# EAGLE schematic PKG900000001527 (EAGLE 7.7.0)

## Sheet 1 of 8
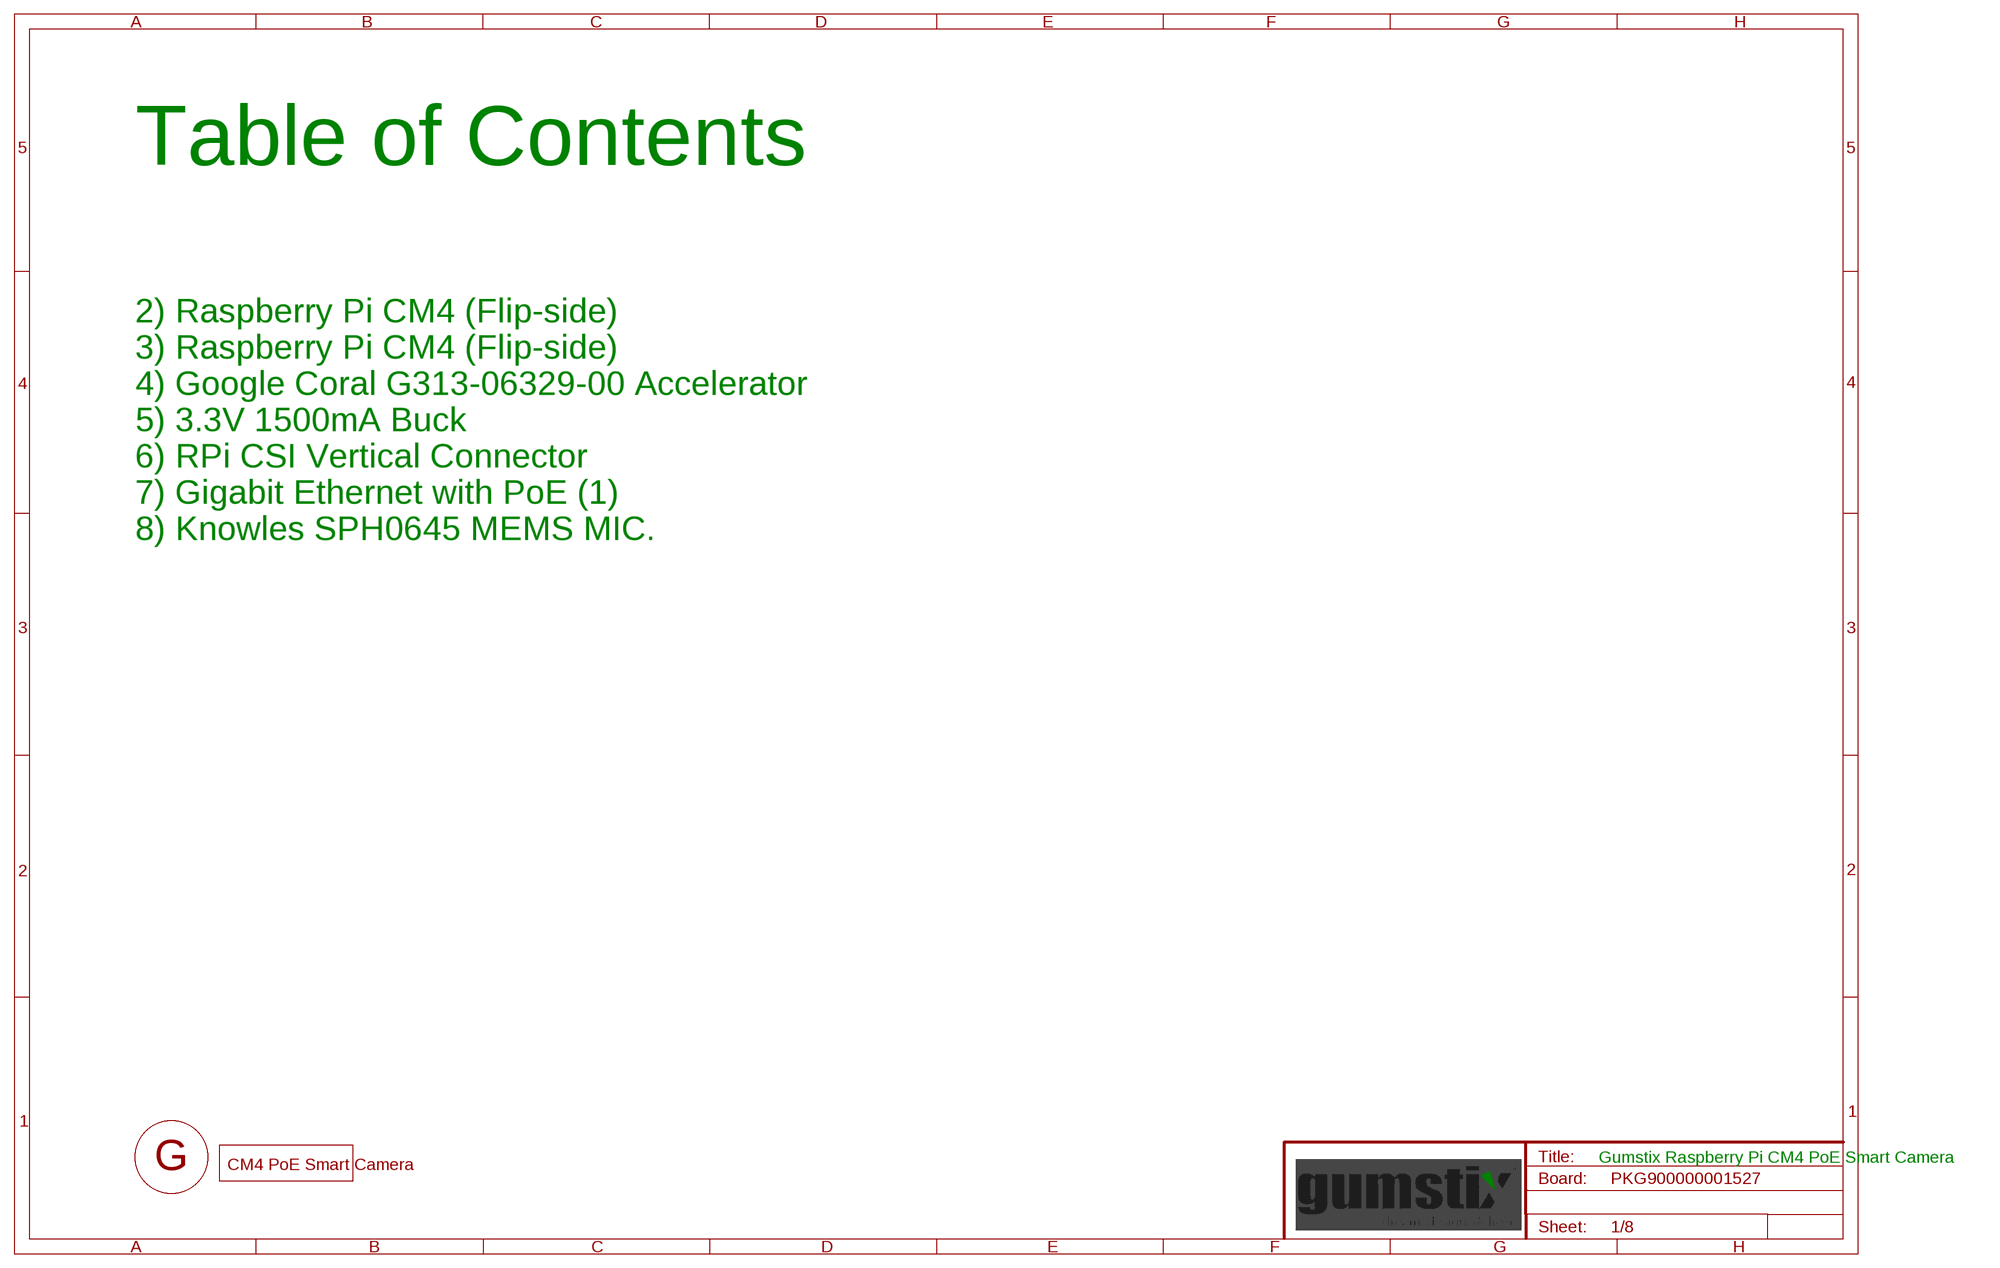
[diagram p0: schematic, sheet 1]

### Parts
FD1  DNP  FIDUCIAL  [FIDUCIAL]
FD2  DNP  FIDUCIAL  [FIDUCIAL]
FD3  DNP  FIDUCIAL  [FIDUCIAL]
FD4  DNP  FIDUCIAL  [FIDUCIAL]
FD5  DNP  FIDUCIAL  [FIDUCIAL]
FD6  DNP  FIDUCIAL  [FIDUCIAL]
U$2  DNP  GEPPETTO_LABEL"  [GEPPETTO_LABEL]
U$3  DNP  GEPPETTO_LOGO10X10  [GEPPETTO_LOGO_SILK10]

### Notes on the sheet
- Table of Contents
- 2) Raspberry Pi CM4 (Flip-side)
- 3) Raspberry Pi CM4 (Flip-side)
- 4) Google Coral G313-06329-00 Accelerator
- 5) 3.3V 1500mA Buck
- 6) RPi CSI Vertical Connector
- 7) Gigabit Ethernet with PoE (1)
- 8) Knowles SPH0645 MEMS MIC.
- Gumstix Raspberry Pi CM4 PoE Smart Camera

## Sheet 2 of 8
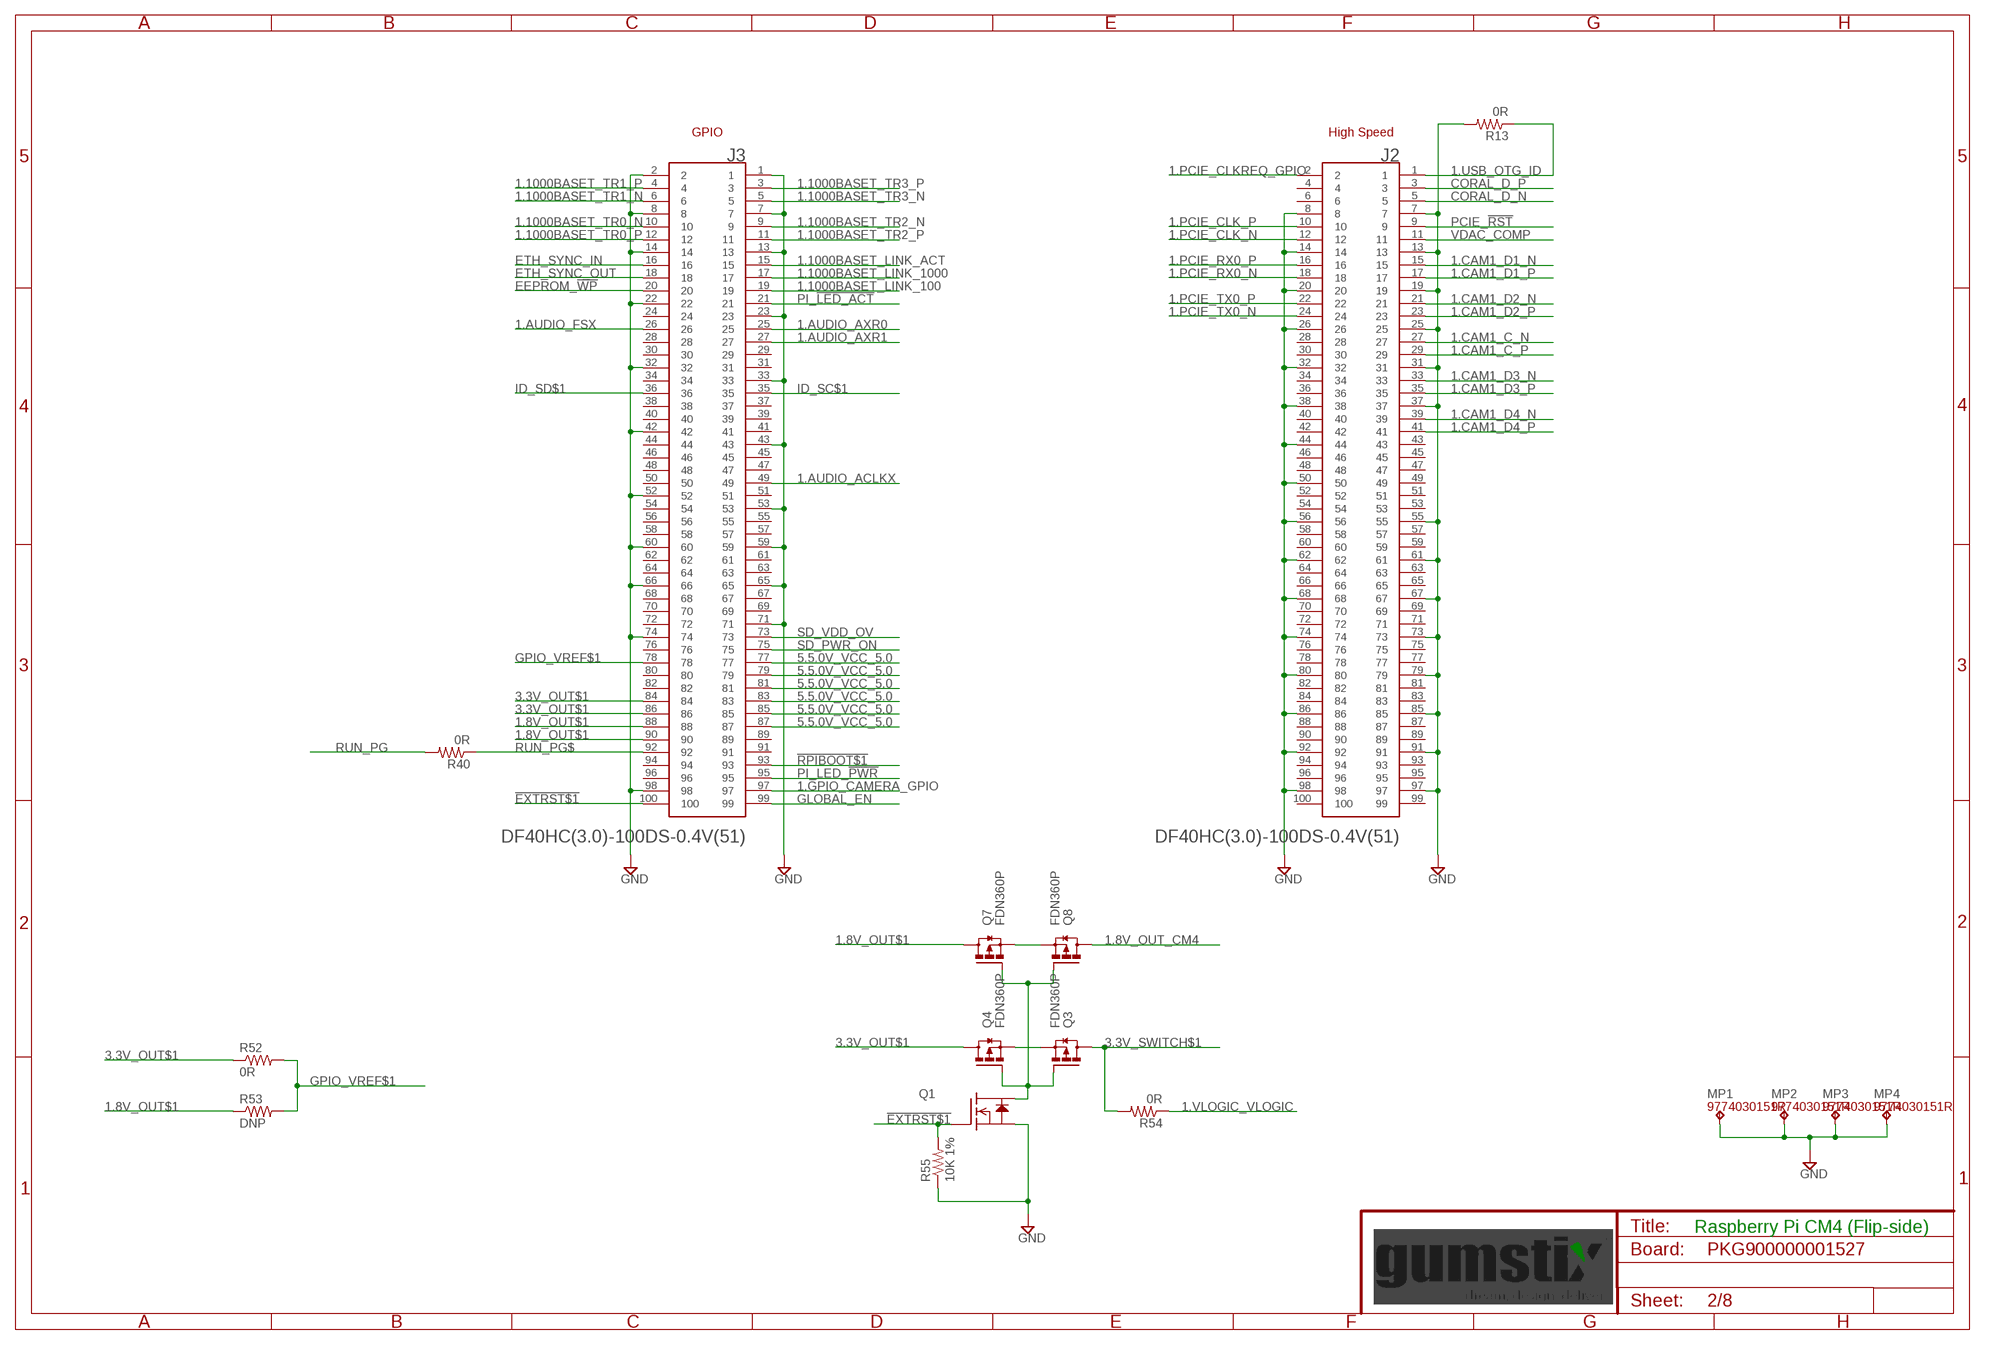
[diagram p1: schematic, sheet 2]

### Parts
J2  DF40HC(3.0)-100DS-0.4V(51)  DF40C-100DS-0.4V(51)  [HRS_DF40C-100DS-0.4V(51)]
J3  DF40HC(3.0)-100DS-0.4V(51)  DF40C-100DS-0.4V(51)  [HRS_DF40C-100DS-0.4V(51)]
MP1  9774030151R  BULLET_CONN2.5MM  [WA-SMSI_9774___151]
MP2  9774030151R  BULLET_CONN2.5MM  [WA-SMSI_9774___151]
MP3  9774030151R  BULLET_CONN2.5MM  [WA-SMSI_9774___151]
MP4  9774030151R  BULLET_CONN2.5MM  [WA-SMSI_9774___151]
Q1  BSS138  [SOT23]
Q3  FDN360P  MOSFET_P_ENH  [SOT23]
Q4  FDN360P  MOSFET_P_ENH  [SOT23]
Q7  FDN360P  MOSFET_P_ENH  [SOT23]
Q8  FDN360P  MOSFET_P_ENH  [SOT23]
R13  0R  R0201  [0201]
R40  0R  R0201  [0201]
R52  0R  R0201  [0201]
R53  DNP  R0201  [0201]
R54  0R  R0201  [0201]
R55  10K 1%  R0201  [0201]

### Nets
1.8V_OUT$1 [supply]: J3.88 J3.90 Q7.3(D) R53.1
1.8V_OUT_CM4: Q8.3(D) ; also sheet 4
1.1000BASET_LINK_100: J3.19
1.1000BASET_LINK_1000: J3.17 ; also sheet 7
1.1000BASET_LINK_ACT: J3.15 ; also sheet 7
1.1000BASET_TR0_N [HDMI]: J3.10 ; also sheet 7
1.1000BASET_TR0_P [HDMI]: J3.12 ; also sheet 7
1.1000BASET_TR1_N [HDMI]: J3.6 ; also sheet 7
1.1000BASET_TR1_P [HDMI]: J3.4 ; also sheet 7
1.1000BASET_TR2_N [HDMI]: J3.9 ; also sheet 7
1.1000BASET_TR2_P [HDMI]: J3.11 ; also sheet 7
1.1000BASET_TR3_N [HDMI]: J3.5 ; also sheet 7
1.1000BASET_TR3_P [HDMI]: J3.3 ; also sheet 7
1.AUDIO_ACLKX: J3.49 ; also sheet 8
1.AUDIO_AXR0: J3.25
1.AUDIO_AXR1: J3.27 ; also sheet 8
1.AUDIO_FSX: J3.26 ; also sheet 8
1.CAM1_C_N [HDMI]: J2.27 ; also sheet 6
1.CAM1_C_P [HDMI]: J2.29 ; also sheet 6
1.CAM1_D1_N [HDMI]: J2.15 ; also sheet 6
1.CAM1_D1_P [HDMI]: J2.17 ; also sheet 6
1.CAM1_D2_N [HDMI]: J2.21 ; also sheet 6
1.CAM1_D2_P [HDMI]: J2.23 ; also sheet 6
1.CAM1_D3_N [HDMI]: J2.33
1.CAM1_D3_P [HDMI]: J2.35
1.CAM1_D4_N [HDMI]: J2.39
1.CAM1_D4_P [HDMI]: J2.41
1.GPIO_CAMERA_GPIO: J3.97 ; also sheet 6
1.PCIE_CLK_N [USB]: J2.12 ; also sheet 4
1.PCIE_CLK_P [USB]: J2.10 ; also sheet 4
1.PCIE_CLKREQ_GPIO: J2.2 ; also sheet 4
1.PCIE_RX0_N [USB]: J2.18 ; also sheet 4
1.PCIE_RX0_P [USB]: J2.16 ; also sheet 4
1.PCIE_TX0_N [USB]: J2.24 ; also sheet 4
1.PCIE_TX0_P [USB]: J2.22 ; also sheet 4
1.USB_OTG_ID: J2.1 R13.1
1.VLOGIC_VLOGIC [supply]: R54.1 ; also sheet 4
3.3V_OUT$1 [supply]: J3.84 J3.86 Q4.3(D) R52.1
3.3V_SWITCH$1 [supply]: Q3.3(D) R54.2
5.5.0V_VCC_5.0 [supply]: J3.77 J3.79 J3.81 J3.83 J3.85 J3.87 ; also sheet 5,7
!EXTRST$1: J3.100 Q1.1(G) R55.2
!RPIBOOT$1: J3.93 ; also sheet 3
CORAL_D_N [USB]: J2.5 ; also sheet 4
CORAL_D_P [USB]: J2.3 ; also sheet 4
DS_LOAD$1 [supply]: Q3.2(S) Q4.2(S)
DS_LOAD_1V8$1 [supply]: Q7.2(S) Q8.2(S)
EEPROM_!WP: J3.20
ETH_SYNC_IN: J3.16
ETH_SYNC_OUT: J3.18
GLOBAL_EN: J3.99
GND [supply]: J2.7 J2.8 J2.13 J2.14 J2.19 J2.20 J2.25 J2.26 J2.31 J2.32 J2.37 J2.38 J2.44 J2.50 J2.55 J2.56 J2.61 J2.62 J2.67 J2.68 J2.73 J2.74 J2.79 J2.80 J2.85 J2.86 J2.91 J2.92 J2.97 J2.98 J3.1 J3.2 J3.7 J3.8 J3.13 J3.14 J3.22 J3.23 J3.32 J3.33 J3.42 J3.43 J3.52 J3.53 J3.59 J3.60 J3.65 J3.66 J3.71 J3.74 J3.98 MP1.1(TP) MP2.1(TP) MP3.1(TP) MP4.1(TP) Q1.2(S) R13.2 R55.1 ; also sheet 3,4,5,6,7,8
GPIO_VREF$1 [supply]: J3.78 R52.2 R53.2 ; also sheet 3
ID_SC$1: J3.35 ; also sheet 3
ID_SD$1: J3.36 ; also sheet 3
LOAD_GATE$1: Q1.3(D) Q3.1(G) Q4.1(G) Q7.1(G) Q8.1(G)
PCIE_!RST: J2.9
PI_!LED_ACT: J3.21
PI_LED_!PWR: J3.95
RUN_PG: R40.2 ; also sheet 4
RUN_PG$: J3.92 R40.1
SD_PWR_ON: J3.75
SD_VDD_OV: J3.73
VDAC_COMP: J2.11
Unconnected: J2.4 J2.6 J2.28 J2.30 J2.34 J2.36 J2.40 J2.42 J2.43 J2.45 J2.46 J2.47 J2.48 J2.49 J2.51 J2.52 J2.53 J2.54 J2.57 J2.58 J2.59 J2.60 J2.63 J2.64 J2.65 J2.66 J2.69 J2.70 J2.71 J2.72 J2.75 J2.76 J2.77 J2.78 J2.81 J2.82 J2.83 J2.84 J2.87 J2.88 J2.89 J2.90 J2.93 J2.94 J2.95 J2.96 J2.99 J2.100 J3.24 J3.28 J3.29 J3.30 J3.31 J3.34 J3.37 J3.38 J3.39 J3.40 J3.41 J3.44 J3.45 J3.46 J3.47 J3.48 J3.50 J3.51 J3.54 J3.55 J3.56 J3.57 J3.58 J3.61 J3.62 J3.63 J3.64 J3.67 J3.68 J3.69 J3.70 J3.72 J3.76 J3.80 J3.82 J3.89 J3.91 J3.94 J3.96

### Notes on the sheet
- GPIO | High Speed
- Raspberry Pi CM4 (Flip-side)

## Sheet 3 of 8
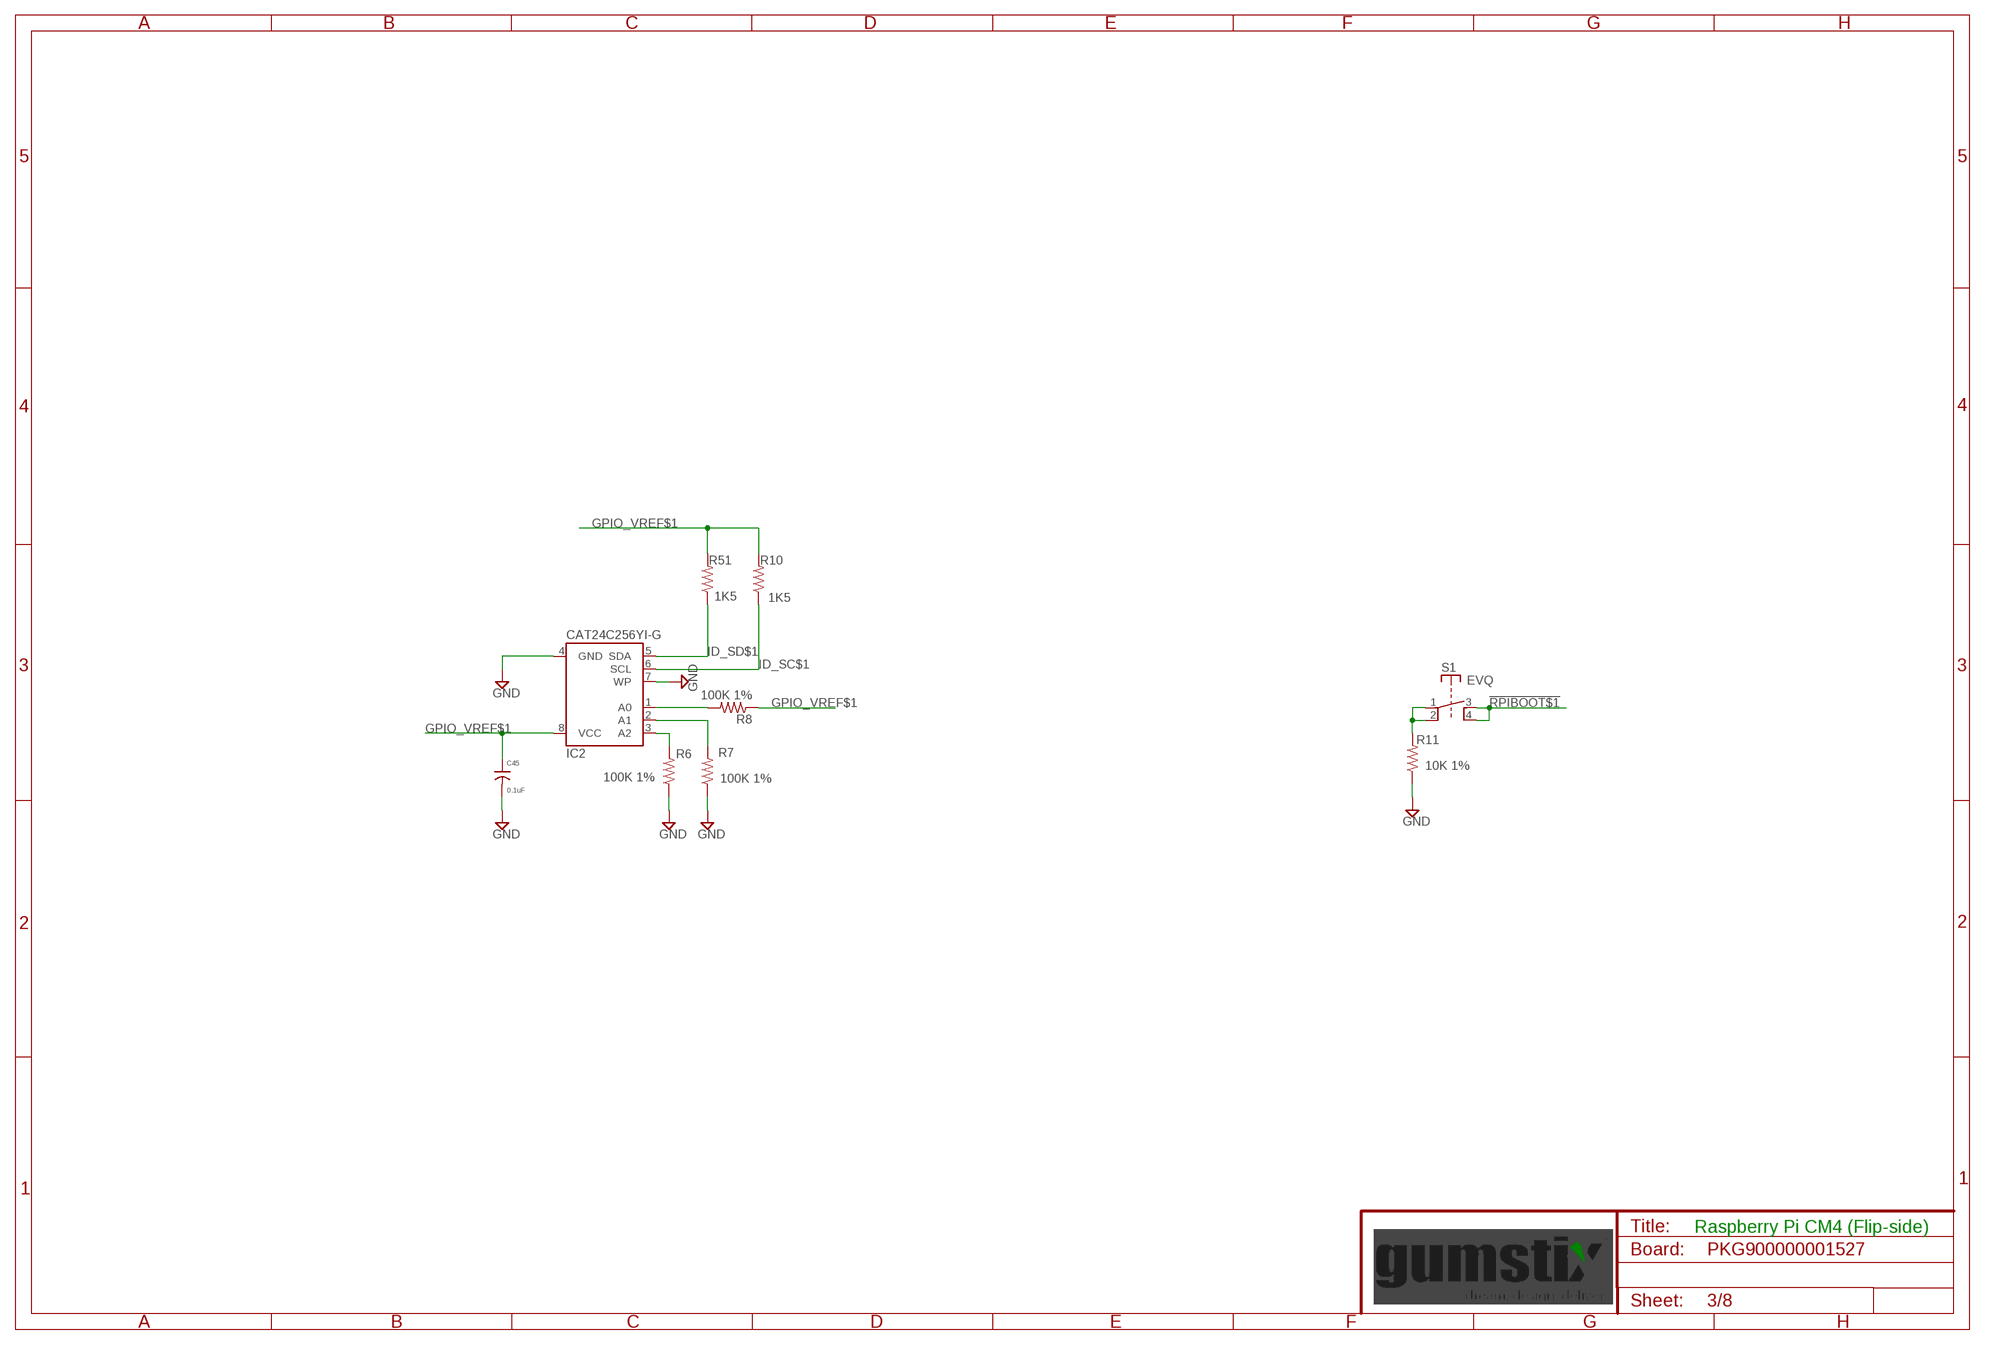
[diagram p2: schematic, sheet 3]

### Parts
C45  0.1uF  C0201  [0201]
IC2  CAT24C256YI-G  AT24CA  [TSSOP8]
R6  100K 1%  R0201  [0201]
R7  100K 1%  R0201  [0201]
R8  100K 1%  R0201  [0201]
R10  1K5  R0201  [0201]
R11  10K 1%  R0201  [0201]
R51  1K5  R0201  [0201]
S1  EVQ  EVQKMT0  [KMT0]

### Nets
!RPIBOOT$1: S1.3(B) S1.4(B') ; also sheet 2
A0$1: IC2.1(A0) R8.2
A1$1: IC2.2(A1) R7.2
A2$1: IC2.3(A2) R6.2
GND [supply]: C45.2 IC2.4(GND) IC2.7(WP) R6.1 R7.1 R11.1 ; also sheet 2,4,5,6,7,8
GPIO_VREF$1 [supply]: C45.1 IC2.8(VCC) R8.1 R10.2 R51.2 ; also sheet 2
ID_SC$1: IC2.6(SCL) R10.1 ; also sheet 2
ID_SD$1: IC2.5(SDA) R51.1 ; also sheet 2
RPIBOOT_SWITCH$1: R11.2 S1.1(A) S1.2(A')

### Notes on the sheet
- Raspberry Pi CM4 (Flip-side)

## Sheet 4 of 8
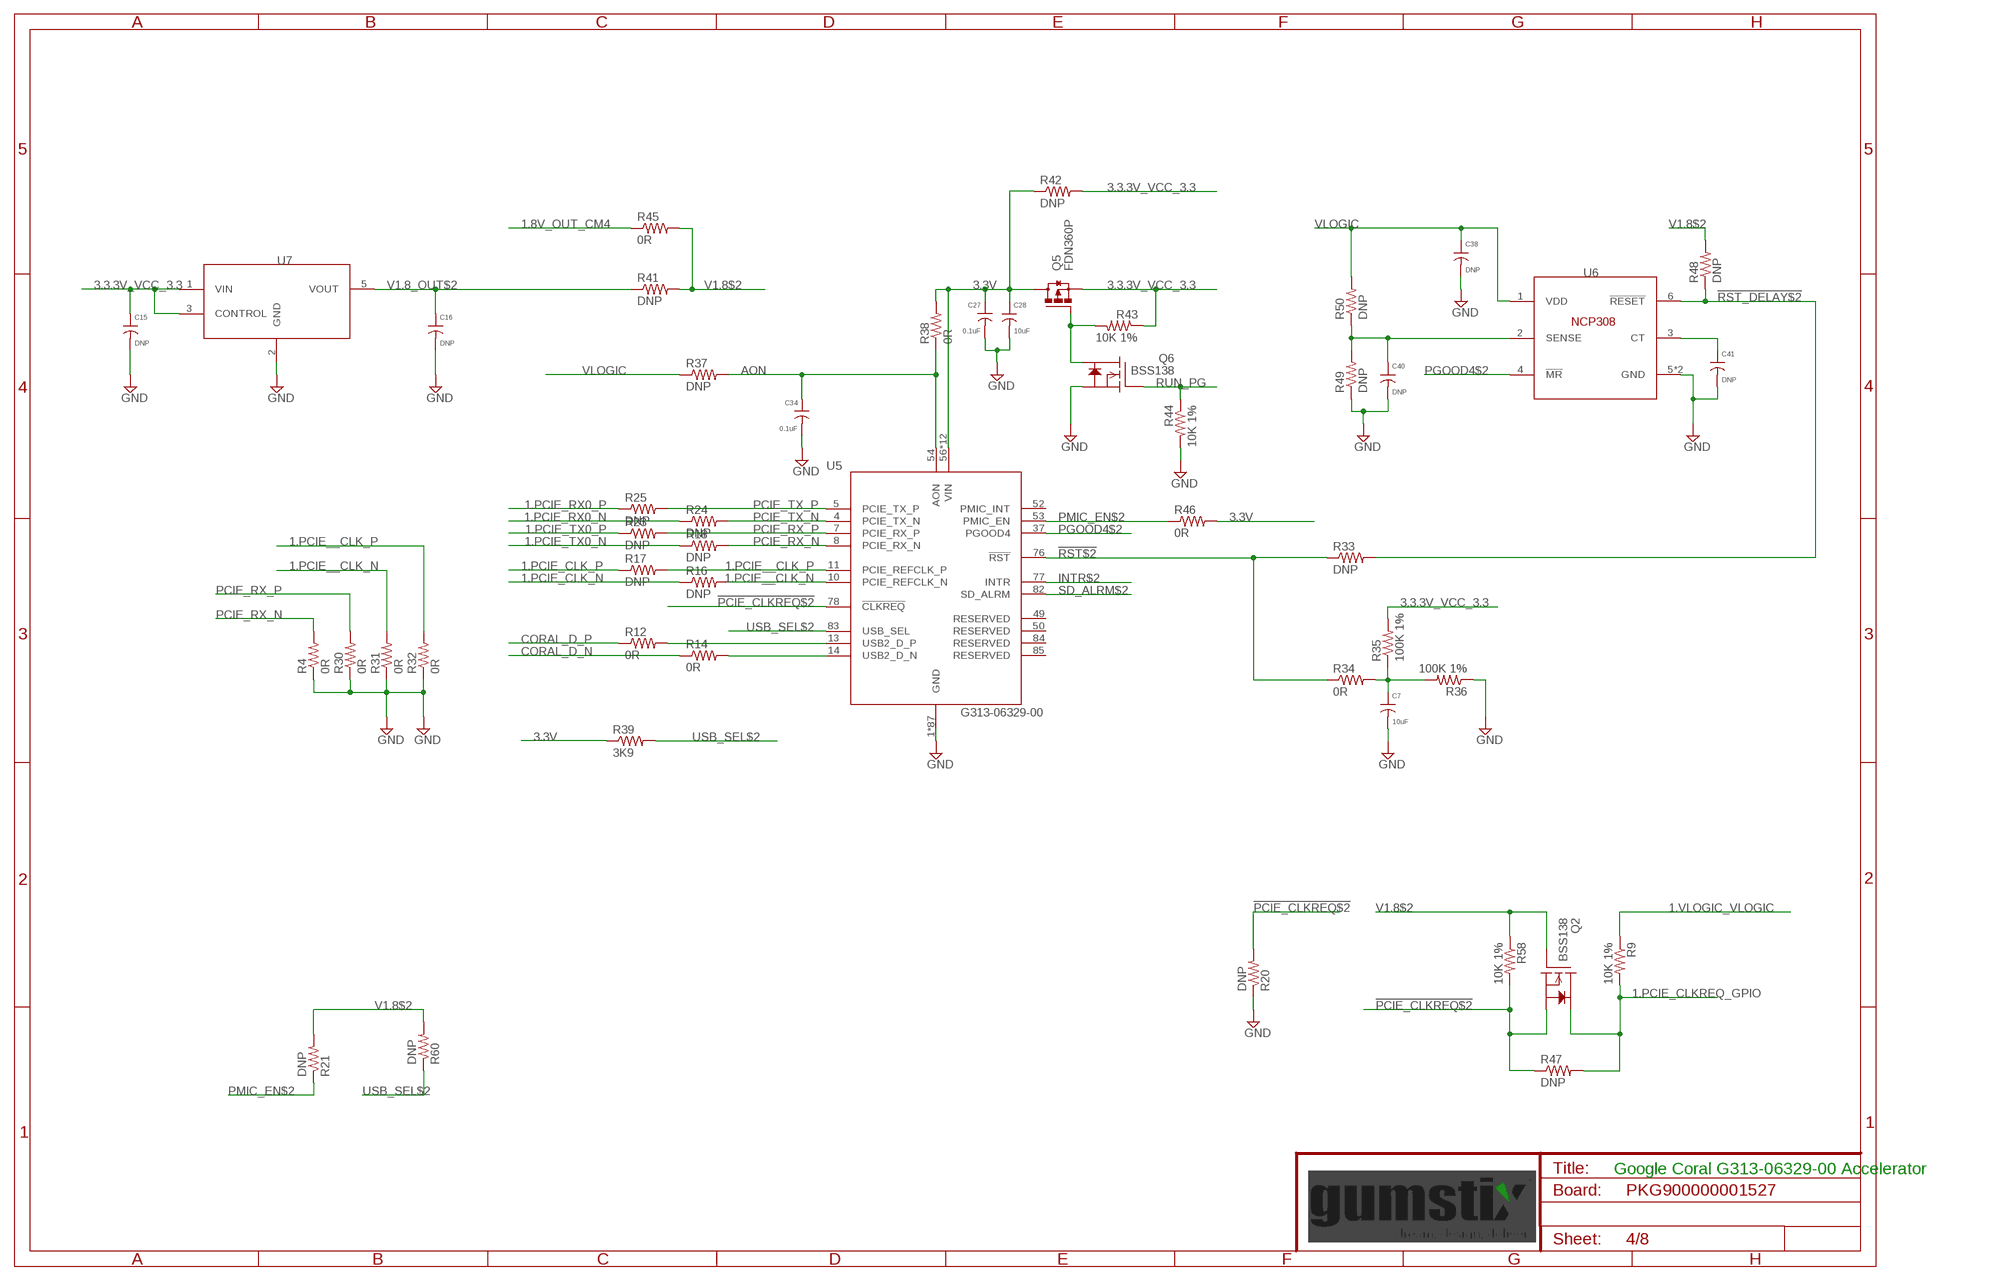
[diagram p3: schematic, sheet 4]

### Parts
C7  10uF  C0603  [0603]
C15  DNP  C0201  [0201]
C16  DNP  C0402  [0402]
C27  0.1uF  C0201  [0201]
C28  10uF  C0603  [0603]
C34  0.1uF  C0201  [0201]
C38  DNP  C0201  [0201]
C40  DNP  C0201  [0201]
C41  DNP  C0201  [0201]
Q2  BSS138  [SOT23]
Q5  FDN360P  MOSFET_P_ENH  [SOT23]
Q6  BSS138  [SOT23]
R4  0R  R0201  [0201]
R9  10K 1%  R0201  [0201]
R12  0R  R0201  [0201]
R14  0R  R0201  [0201]
R16  DNP  R0201  [0201]
R17  DNP  R0201  [0201]
R18  DNP  R0201  [0201]
R20  DNP  R0201  [0201]
R21  DNP  R0201  [0201]
R23  DNP  R0201  [0201]
R24  DNP  R0201  [0201]
R25  DNP  R0201  [0201]
R30  0R  R0201  [0201]
R31  0R  R0201  [0201]
R32  0R  R0201  [0201]
R33  DNP  R0201  [0201]
R34  0R  R0201  [0201]
R35  100K 1%  R0201  [0201]
R36  100K 1%  R0201  [0201]
R37  DNP  R0201  [0201]
R38  0R  R0201  [0201]
R39  3K9  R0201  [0201]
R41  DNP  R0603  [0603]
R42  DNP  R0805  [0805]
R43  10K 1%  R0201  [0201]
R44  10K 1%  R0201  [0201]
R45  0R  R0603  [0603]
R46  0R  R0201  [0201]
R47  DNP  R0201  [0201]
R48  DNP  R0201  [0201]
R49  DNP  R0201  [0201]
R50  DNP  R0201  [0201]
R58  10K 1%  R0201  [0201]
R60  DNP  R0201  [0201]
U5  G313-06329-00  [G313-06329-00]
U6  DNP  NCP308  [WDFN6]
U7  DNP  TCR2EF18  [SOT-23-5]

### Nets
1.8V_OUT_CM4: R45.1 ; also sheet 2
1.PCIE__CLK_N [USB]: R16.2 R31.2 U5.10(PCIE_REFCLK_N)
1.PCIE__CLK_P [USB]: R17.2 R32.2 U5.11(PCIE_REFCLK_P)
1.PCIE_CLK_N [USB]: R16.1 ; also sheet 2
1.PCIE_CLK_P [USB]: R17.1 ; also sheet 2
1.PCIE_CLKREQ_GPIO: Q2.3(D) R9.2 R47.2 ; also sheet 2
1.PCIE_RX0_N [USB]: R24.1 ; also sheet 2
1.PCIE_RX0_P [USB]: R25.1 ; also sheet 2
1.PCIE_TX0_N [USB]: R18.1 ; also sheet 2
1.PCIE_TX0_P [USB]: R23.1 ; also sheet 2
1.VLOGIC_VLOGIC [supply]: R9.1 ; also sheet 2
3.3.3V_VCC_3.3 [supply]: C15.1 Q5.2(S) R35.2 R42.2 R43.1 U7.1(VIN) U7.3(CONTROL) ; also sheet 5,6,7,8
3.3V [supply]: C27.1 C28.1 Q5.3(D) R38.2 R39.1 R42.1 R46.2 U5.56(VIN) U5.57(VIN) U5.58(VIN) U5.59(VIN) U5.60(VIN) U5.61(VIN) U5.62(VIN) U5.63(VIN) U5.64(VIN) U5.65(VIN) U5.66(VIN) U5.67(VIN)
!PCIE_CLKREQ$2: Q2.2(S) R20.2 R47.1 R58.2 U5.78(!CLKREQ)
!RST$2: R33.1 R34.1 U5.76(!RST)
!RST_DELAY$2: R33.2 R48.1 U6.6(!RESET)
AON [supply]: C34.1 R37.2 R38.1 U5.54(AON)
CORAL_D__N [USB]: R14.2 U5.14(USB2_D_N)
CORAL_D__P [USB]: R12.2 U5.13(USB2_D_P)
CORAL_D_N [USB]: R14.1 ; also sheet 2
CORAL_D_P [USB]: R12.1 ; also sheet 2
CT1$2 [supply]: C41.1 U6.3(CT)
FET_ENABLE: Q5.1(G) Q6.3(D) R43.2
GND [supply]: C7.2 C15.2 C16.2 C27.2 C28.2 C34.2 C38.2 C40.2 C41.2 Q6.2(S) R4.1 R20.1 R30.1 R31.1 R32.1 R36.1 R44.2 R49.1 U5.1(GND) U5.2(GND) U5.3(GND) U5.6(GND) U5.9(GND) U5.12(GND) U5.15(GND) U5.16(GND) U5.17(GND) U5.18(GND) U5.19(GND) U5.20(GND) U5.21(GND) U5.22(GND) U5.23(GND) U5.24(GND) U5.25(GND) U5.26(GND) U5.27(GND) U5.28(GND) U5.29(GND) U5.30(GND) U5.31(GND) U5.32(GND) U5.33(GND) U5.34(GND) U5.35(GND) U5.36(GND) U5.38(GND) U5.39(GND) U5.40(GND) U5.41(GND) U5.42(GND) U5.43(GND) U5.44(GND) U5.45(GND) U5.46(GND) U5.47(GND) U5.48(GND) U5.51(GND) U5.55(GND) U5.68(GND) U5.69(GND) U5.70(GND) U5.71(GND) U5.72(GND) U5.73(GND) U5.74(GND) U5.75(GND) U5.79(GND) U5.80(GND) U5.81(GND) U5.86(GND) U5.87(GND) U5.88(GND) U5.89(GND) U5.90(GND) U5.91(GND) U5.92(GND) U5.93(GND) U5.94(GND) U5.95(GND) U5.96(GND) U5.97(GND) U5.98(GND) U5.99(GND) U5.100(GND) U5.101(GND) U5.102(GND) U5.103(GND) U5.104(GND) U5.105(GND) U5.106(GND) U5.107(GND) U5.108(GND) U5.109(GND) U5.110(GND) U5.111(GND) U5.112(GND) U5.113(GND) U5.114(GND) U5.115(GND) U5.116(GND) U5.117(GND) U5.118(GND) U5.119(GND) U5.120(GND) U6.5(GND) U6.EPAD(GND) U7.2(GND) ; also sheet 2,3,5,6,7,8
INTR$2: U5.77(INTR)
PCIE_RX_N [USB]: R4.2 R18.2 U5.8(PCIE_RX_N)
PCIE_RX_P [USB]: R23.2 R30.2 U5.7(PCIE_RX_P)
PCIE_TX_N [USB]: R24.2 U5.4(PCIE_TX_N)
PCIE_TX_P [USB]: R25.2 U5.5(PCIE_TX_P)
PGOOD4$2: U5.37(PGOOD4) U6.4(!MR)
PMIC_EN$2: R21.1 R46.1 U5.53(PMIC_EN)
RST_RC$: C7.1 R34.2 R35.1 R36.2
RUN_PG: Q6.1(G) R44.1 ; also sheet 2
SD_ALRM$2: U5.82(SD_ALRM)
SENSE$2: C40.1 R49.2 R50.1 U6.2(SENSE)
USB_SEL$2: R39.2 R60.1 U5.83(USB_SEL)
V1.8$2 [supply]: Q2.1(G) R21.2 R41.2 R45.2 R48.2 R58.1 R60.2
V1.8_OUT$2 [supply]: C16.1 R41.1 U7.5(VOUT)
VLOGIC [supply]: C38.1 R37.1 R50.2 U6.1(VDD)
Unconnected: U5.49(RESERVED) U5.50(RESERVED) U5.52(PMIC_INT) U5.84(RESERVED) U5.85(RESERVED)

### Notes on the sheet
- Google Coral G313-06329-00 Accelerator

## Sheet 5 of 8
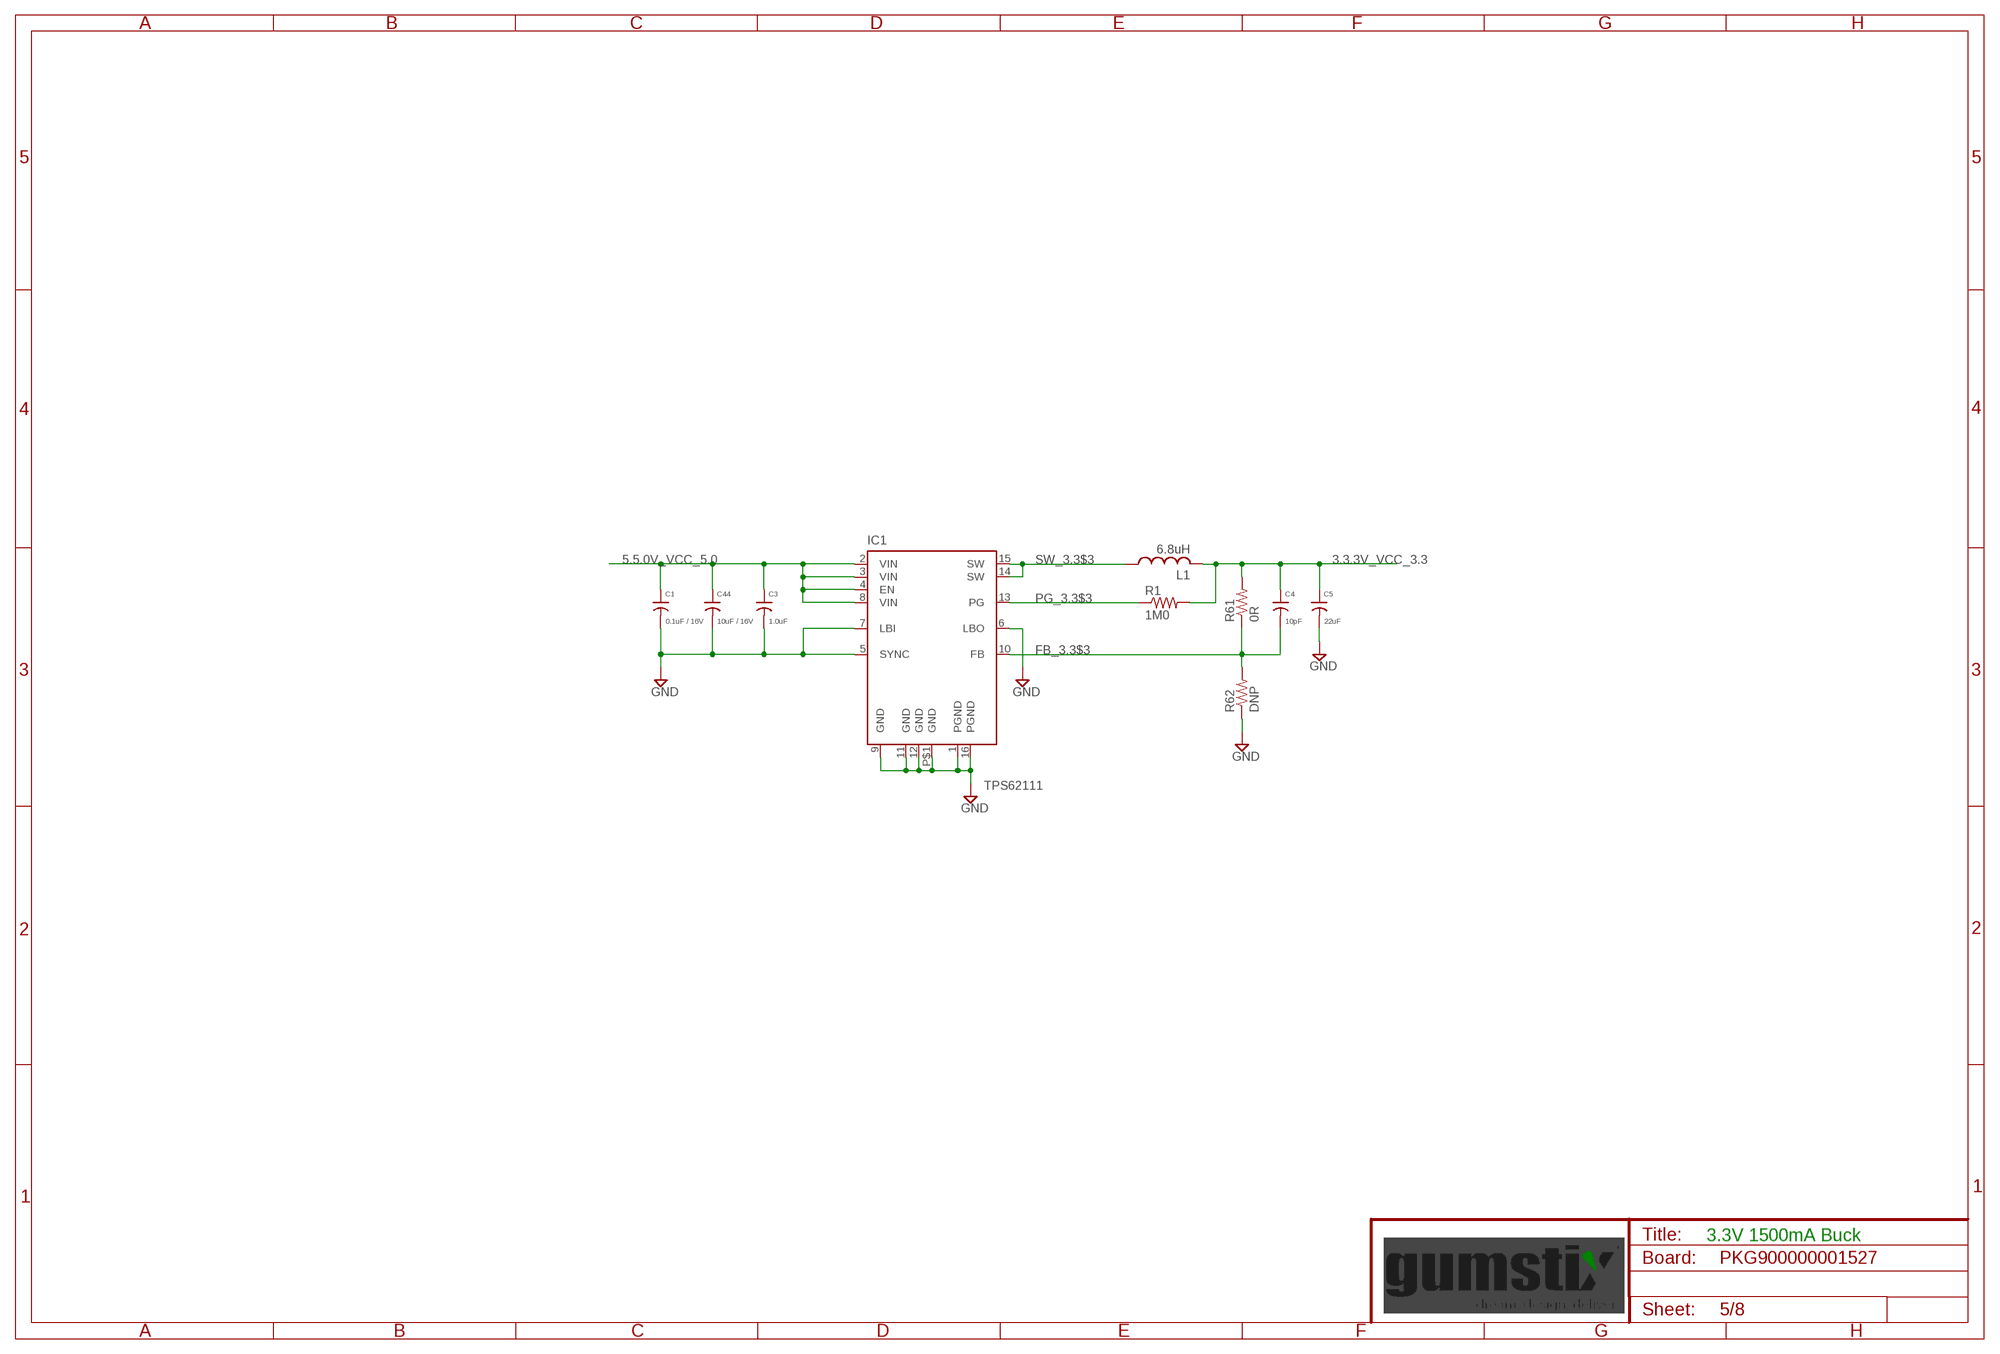
[diagram p4: schematic, sheet 5]

### Parts
C1  0.1uF / 16V  C0402  [0402]
C3  1.0uF  C0402  [0402]
C4  10pF  C0201  [0201]
C5  22uF  C0805  [0805]
C44  10uF / 16V  C0805  [0805]
IC1  TPS62111  [PQFP16]
L1  6.8uH  L1515  [1515]
R1  1M0  R0201  [0201]
R61  0R  R0402  [0402]
R62  DNP  R0402  [0402]

### Nets
3.3.3V_VCC_3.3 [supply]: C4.1 C5.1 L1.2 R1.2 R61.2 ; also sheet 4,6,7,8
5.5.0V_VCC_5.0 [supply]: C1.1 C3.1 C44.1 IC1.2(VIN) IC1.3(VIN) IC1.4(EN) IC1.8(VIN) ; also sheet 2,7
FB_3.3$3 [supply]: C4.2 IC1.10(FB) R61.1 R62.2
GND [supply]: C1.2 C3.2 C5.2 C44.2 IC1.1(PGND) IC1.5(SYNC) IC1.6(LBO) IC1.7(LBI) IC1.9(GND) IC1.11(GND) IC1.12(GND) IC1.16(PGND) IC1.P$1(GND) R62.1 ; also sheet 2,3,4,6,7,8
PG_3.3$3: IC1.13(PG) R1.1
SW_3.3$3 [supply]: IC1.14(SW) IC1.15(SW) L1.1

### Notes on the sheet
- 3.3V 1500mA Buck

## Sheet 6 of 8
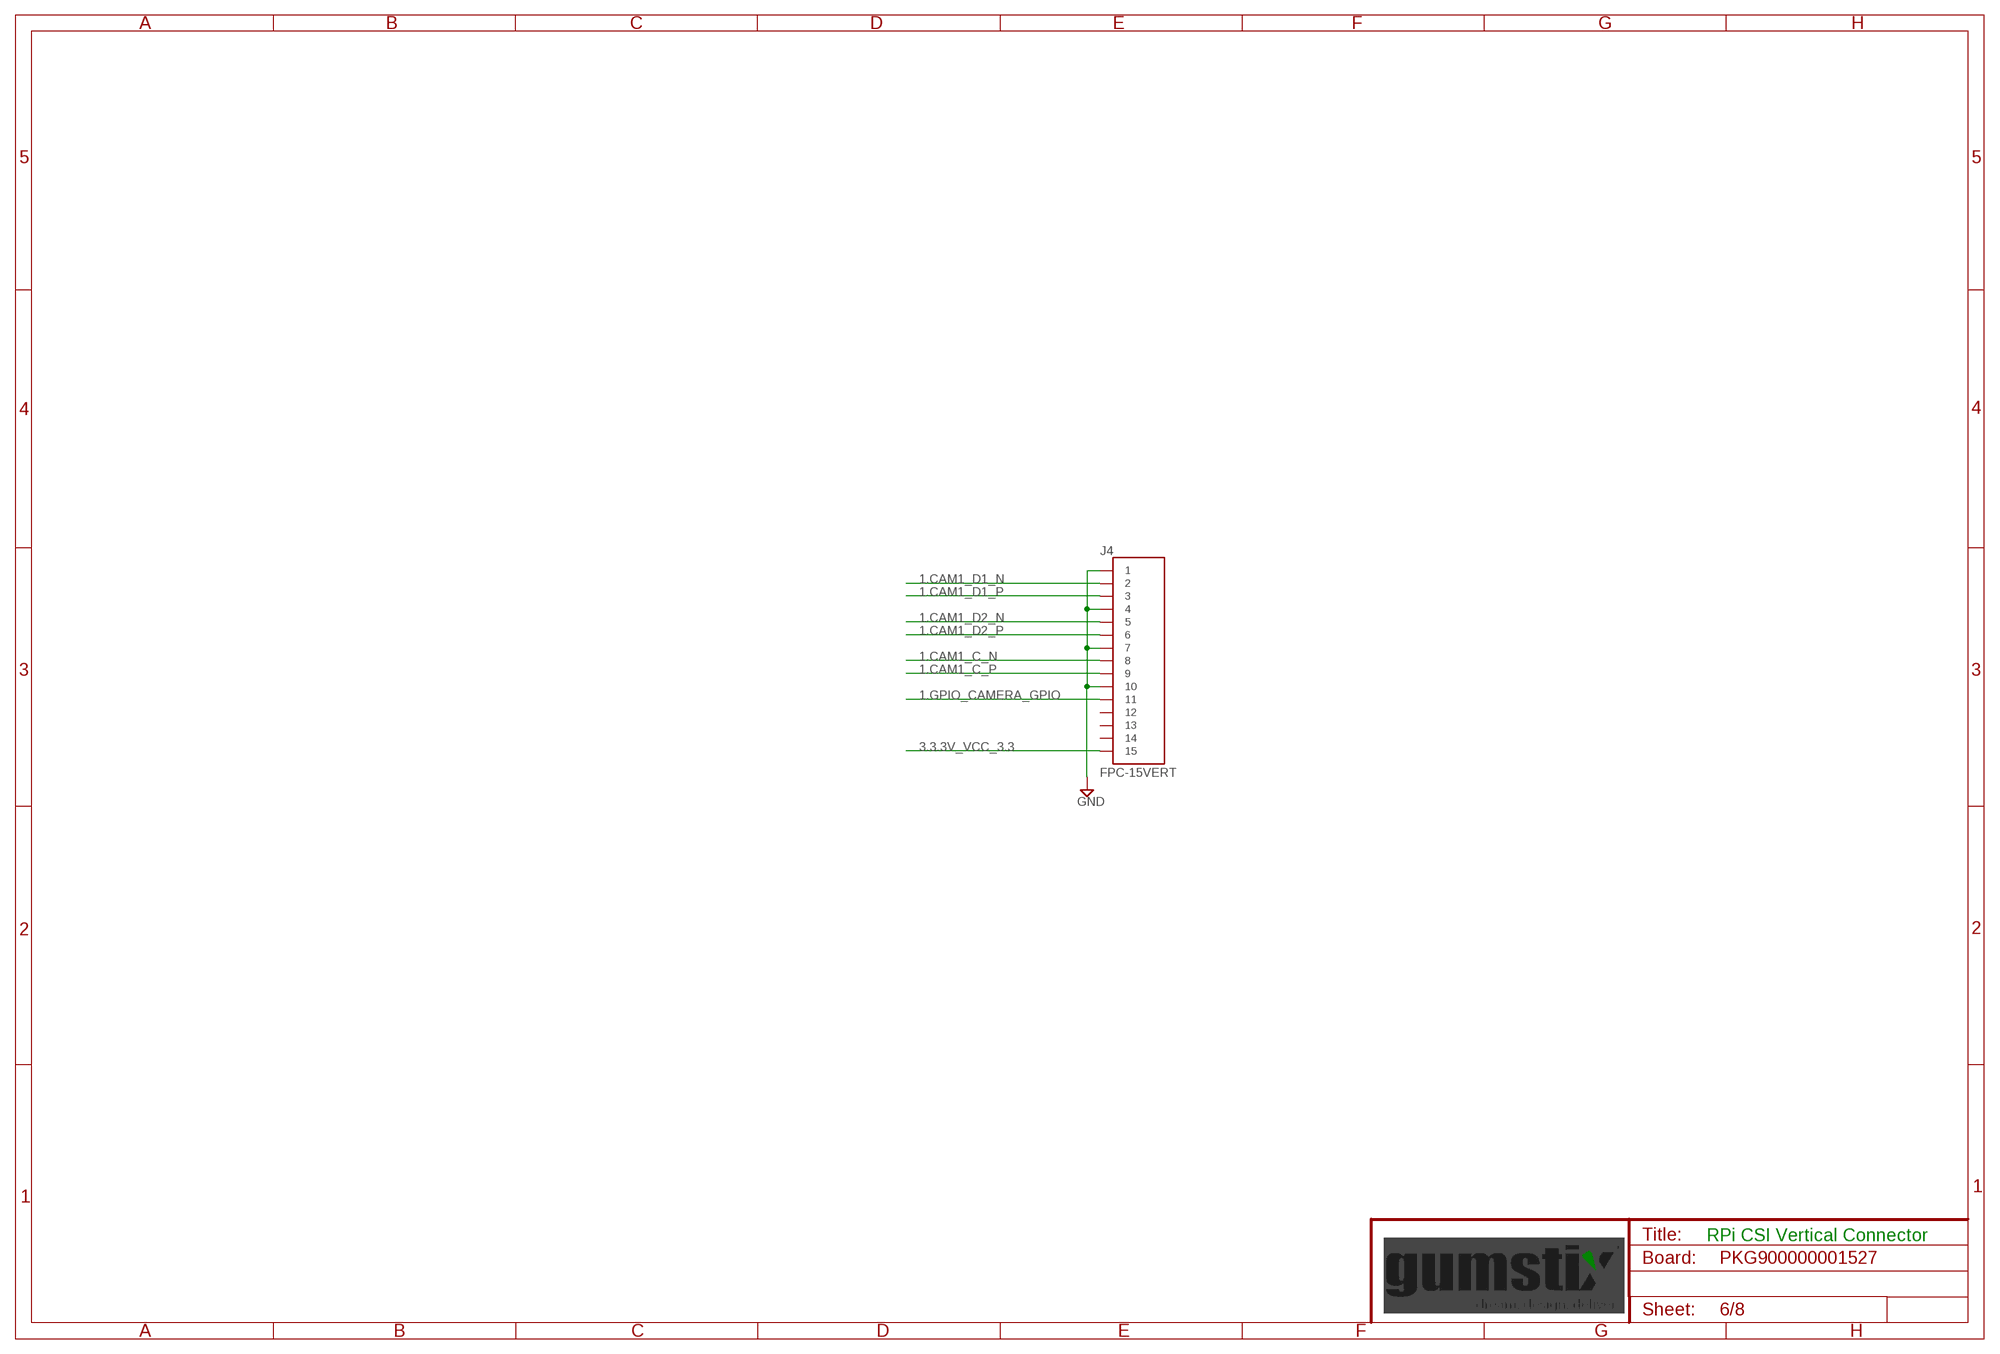
[diagram p5: schematic, sheet 6]

### Parts
J4  FPC-15VERT  [1-1734248-5]

### Nets
1.CAM1_C_N [HDMI]: J4.1_8 ; also sheet 2
1.CAM1_C_P [HDMI]: J4.1_9 ; also sheet 2
1.CAM1_D1_N [HDMI]: J4.1_2 ; also sheet 2
1.CAM1_D1_P [HDMI]: J4.1_3 ; also sheet 2
1.CAM1_D2_N [HDMI]: J4.1_5 ; also sheet 2
1.CAM1_D2_P [HDMI]: J4.1_6 ; also sheet 2
1.GPIO_CAMERA_GPIO: J4.1_11 ; also sheet 2
3.3.3V_VCC_3.3 [supply]: J4.1_15 ; also sheet 4,5,7,8
GND [supply]: J4.1_1 J4.1_4 J4.1_7 J4.1_10 ; also sheet 2,3,4,5,7,8
Unconnected: J4.1_12 J4.1_13 J4.1_14

### Notes on the sheet
- RPi CSI Vertical Connector

## Sheet 7 of 8
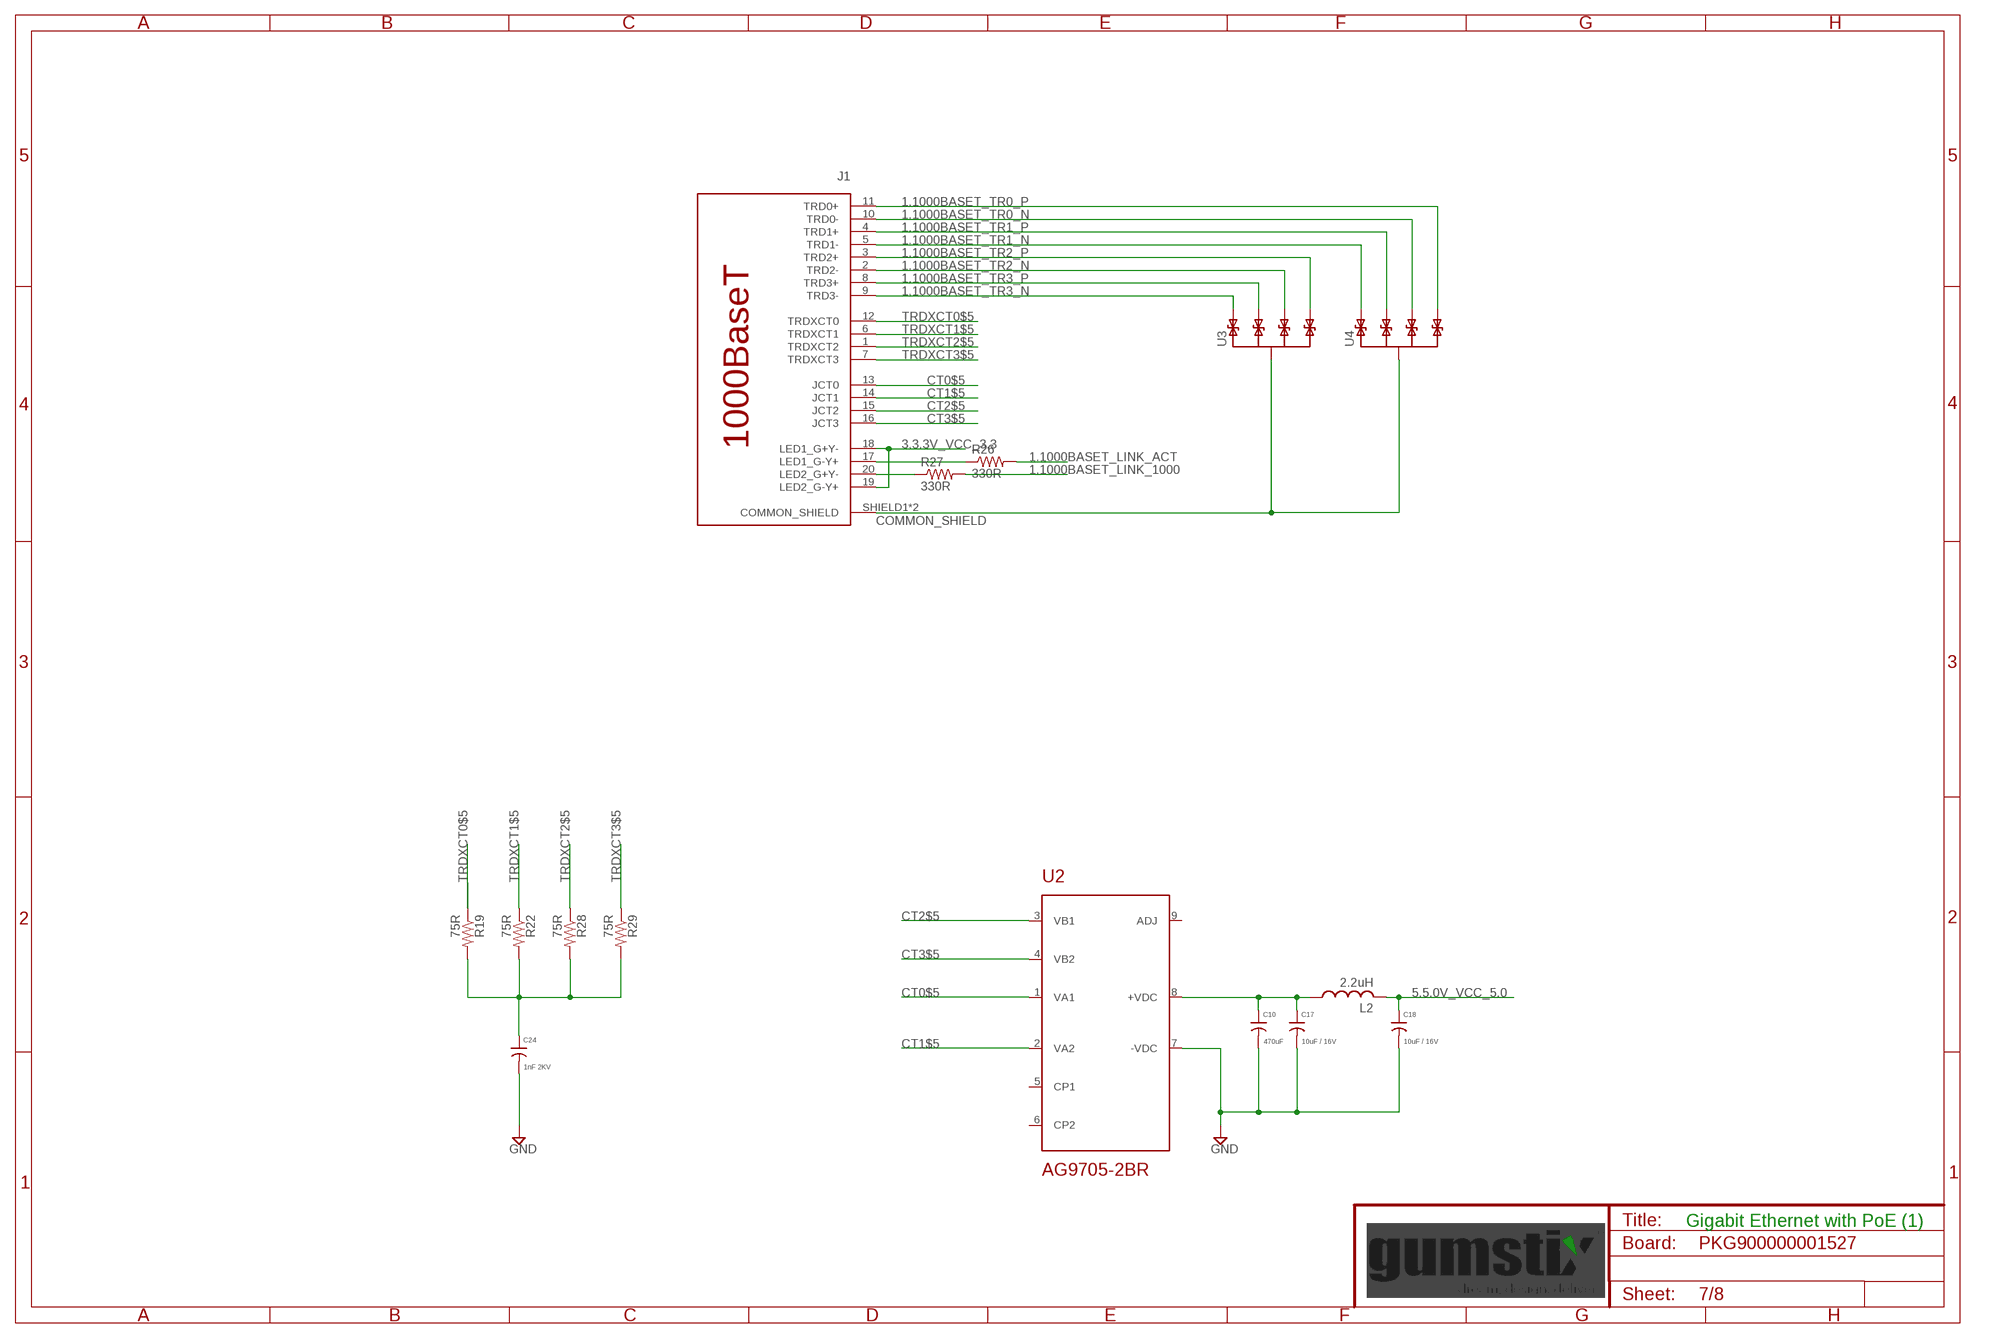
[diagram p6: schematic, sheet 7]

### Parts
C10  470uF  CPANASONIC_F  [PANASONIC_F]
C17  10uF / 16V  C0805  [0805]
C18  10uF / 16V  C0805  [0805]
C24  1nF 2KV  C1206  [1206]
J1  1000BASET_POE  [7499511440]
L2  2.2uH  L1515  [1515]
R19  75R  R0402  [0402]
R22  75R  R0402  [0402]
R26  330R  R0402  [0402]
R27  330R  R0402  [0402]
R28  75R  R0402  [0402]
R29  75R  R0402  [0402]
U2  AG9705-2BR  AG9700  [AG9700]
U3  TPD4E02B0410-USON  [UFDFN-10]
U4  TPD4E02B0410-USON  [UFDFN-10]

### Nets
1.1000BASET_LINK_1000: R27.2 ; also sheet 2
1.1000BASET_LINK_ACT: R26.2 ; also sheet 2
1.1000BASET_TR0_N [HDMI]: J1.10(TRD0-) U4.4(P3) U4.7(P3) ; also sheet 2
1.1000BASET_TR0_P [HDMI]: J1.11(TRD0+) U4.5(P4) U4.6(P4) ; also sheet 2
1.1000BASET_TR1_N [HDMI]: J1.5(TRD1-) U4.1 U4.10(P1) ; also sheet 2
1.1000BASET_TR1_P [HDMI]: J1.4(TRD1+) U4.2 U4.9(P2) ; also sheet 2
1.1000BASET_TR2_N [HDMI]: J1.2(TRD2-) U3.4(P3) U3.7(P3) ; also sheet 2
1.1000BASET_TR2_P [HDMI]: J1.3(TRD2+) U3.5(P4) U3.6(P4) ; also sheet 2
1.1000BASET_TR3_N [HDMI]: J1.9(TRD3-) U3.1 U3.10(P1) ; also sheet 2
1.1000BASET_TR3_P [HDMI]: J1.8(TRD3+) U3.2 U3.9(P2) ; also sheet 2
3.3.3V_VCC_3.3 [supply]: J1.18(LED1_G+Y-) J1.19(LED2_G-Y+) ; also sheet 4,5,6,8
5.5.0V_VCC_5.0 [supply]: C18.1 L2.2 ; also sheet 2,5
COMMON_SHIELD [supply]: J1.SHIELD1(COMMON_SHIELD) J1.SHIELD2(COMMON_SHIELD) U3.3(SHIELD) U3.8(SHIELD) U4.3(SHIELD) U4.8(SHIELD)
CT0$5 [analog]: J1.13(JCT0) U2.1(VA1)
CT1$5 [analog]: J1.14(JCT1) U2.2(VA2)
CT2$5 [analog]: J1.15(JCT2) U2.3(VB1)
CT3$5 [analog]: J1.16(JCT3) U2.4(VB2)
GND [supply]: C10.- C17.2 C18.2 C24.2 U2.7(-VDC) ; also sheet 2,3,4,5,6,8
MFA0_R$5: J1.20(LED2_G+Y-) R27.1
MFA1_R$5 [HDMI]: J1.17(LED1_G-Y+) R26.1
TRDXCT0$5: J1.12(TRDXCT0) R19.1
TRDXCT1$5: J1.6(TRDXCT1) R22.1
TRDXCT2$5 [HDMI]: J1.1(TRDXCT2) R28.1
TRDXCT3$5 [HDMI]: J1.7(TRDXCT3) R29.1
TRDXCT_COMMON$5 [supply]: C24.1 R19.2 R22.2 R28.2 R29.2
V3.3_UNFILT$5 [supply]: C10.+ C17.1 L2.1 U2.8(+VDC)
Unconnected: U2.5(CP1) U2.6(CP2) U2.9(ADJ)

### Notes on the sheet
- Gigabit Ethernet with PoE (1)

## Sheet 8 of 8
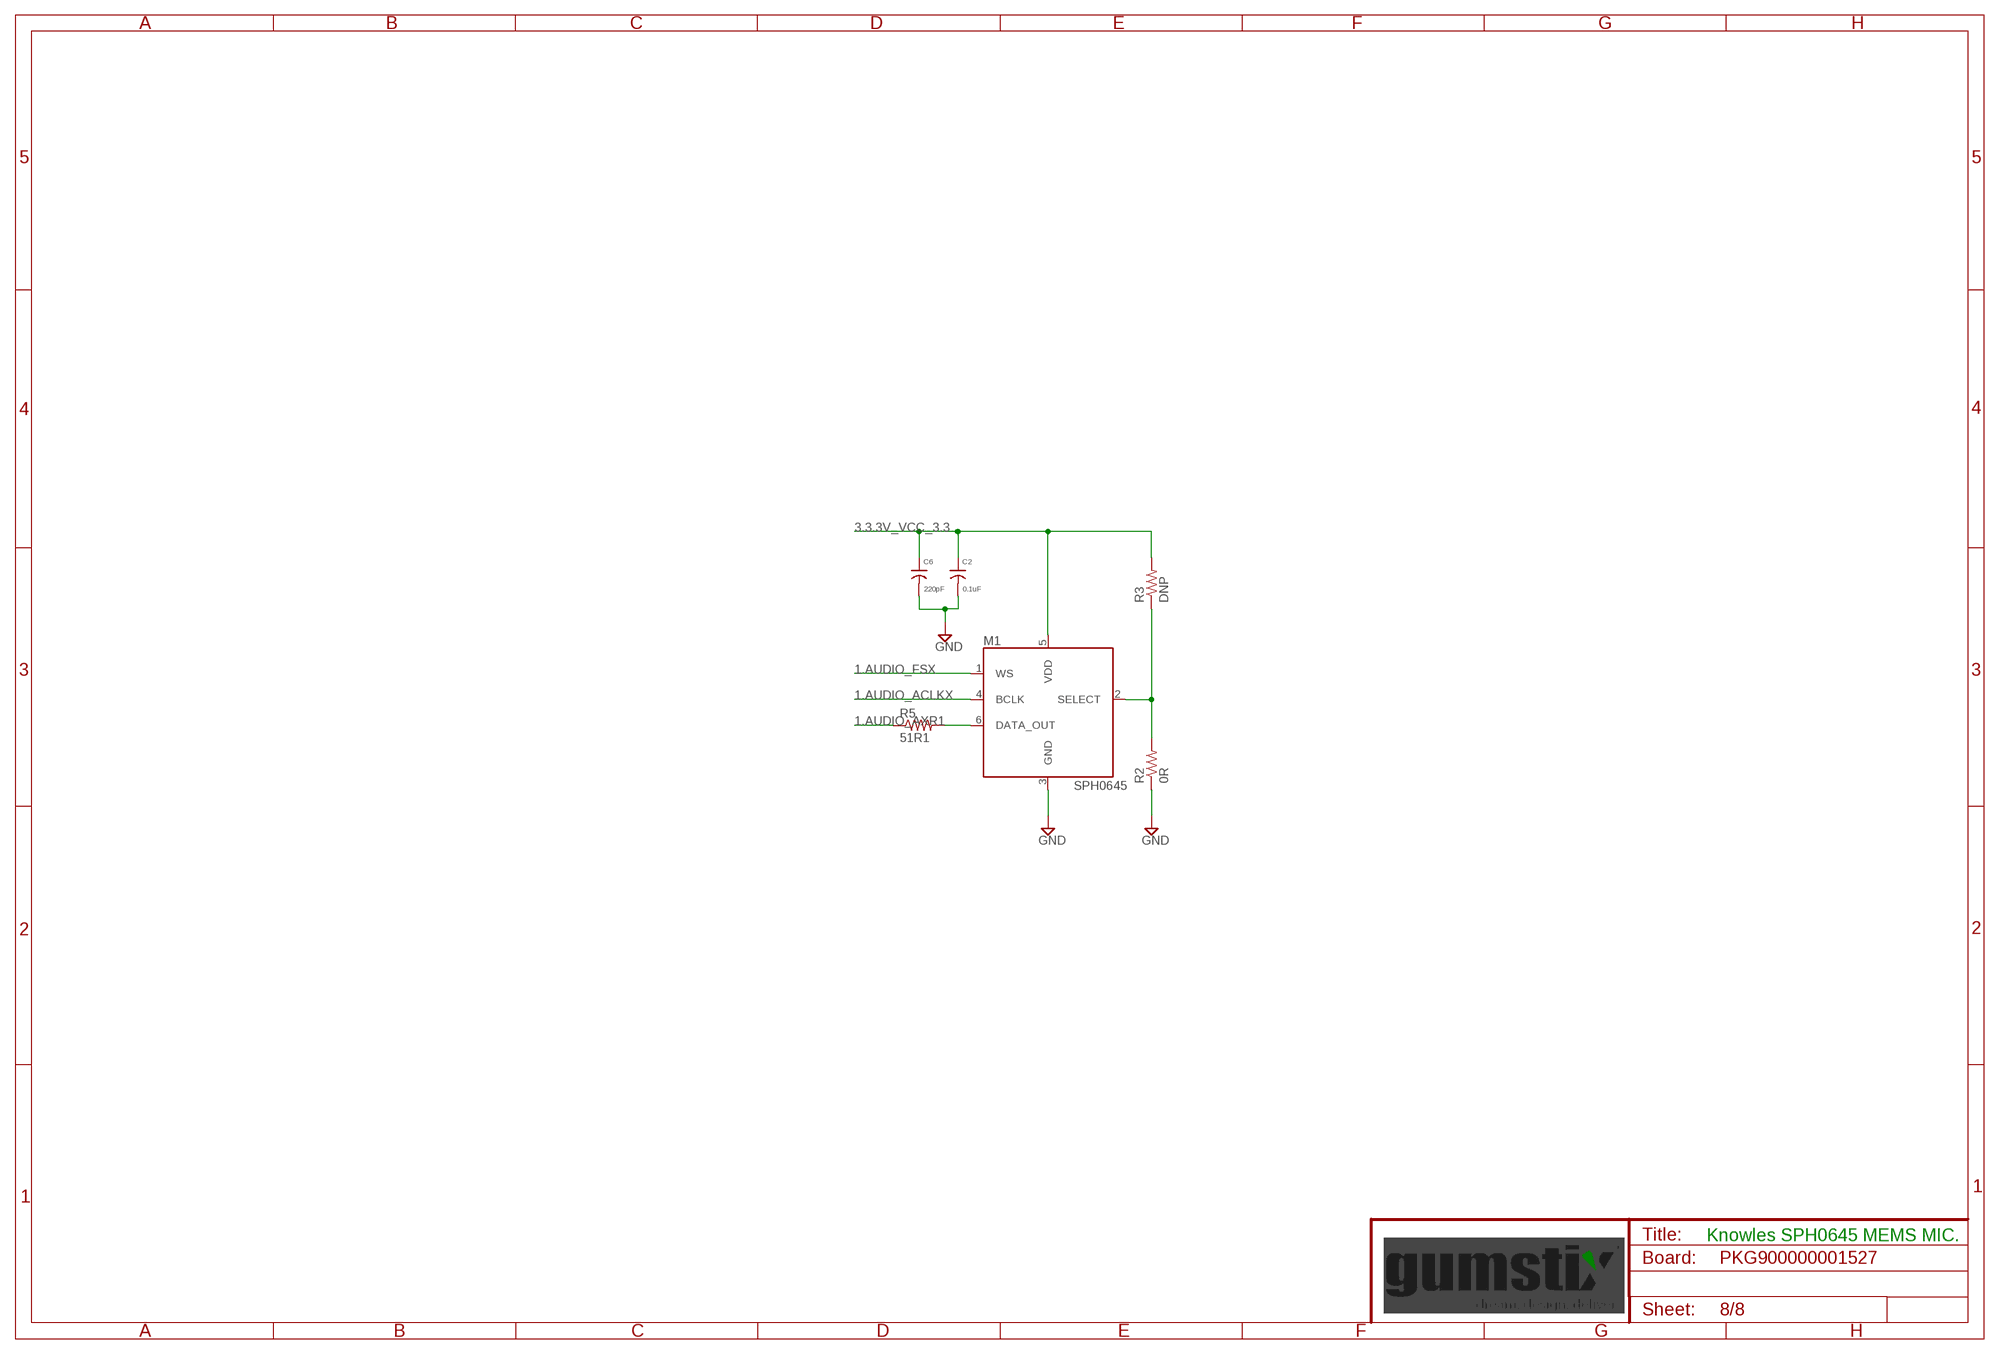
[diagram p7: schematic, sheet 8]

### Parts
C2  0.1uF  C0201  [0201]
C6  220pF  C0201  [0201]
M1  SPH0645  SPH0645LM4H-B  [SPH0645]
R2  0R  R0201  [0201]
R3  DNP  R0201  [0201]
R5  51R1  R0402  [0402]

### Nets
1.AUDIO_ACLKX: M1.4(BCLK) ; also sheet 2
1.AUDIO_AXR1: R5.1 ; also sheet 2
1.AUDIO_FSX: M1.1(WS) ; also sheet 2
3.3.3V_VCC_3.3 [supply]: C2.1 C6.1 M1.5(VDD) R3.2 ; also sheet 4,5,6,7
GND [supply]: C2.2 C6.2 M1.3(GND) R2.1 ; also sheet 2,3,4,5,6,7
SDI$7: M1.6(DATA_OUT) R5.2
SELECT$7: M1.2(SELECT) R2.2 R3.1

### Notes on the sheet
- Knowles SPH0645 MEMS MIC.

## Library data of the parts
C1 = qualified_1:C; DM: 0; DR: -90.000; DX: 1.400; DY: -9.000; HEIGHT: 0.35; SHEETNO: 9
C2 C4 C6 C15 C27 C34 C38 C40 C41 C45 = qualified_1:C; HEIGHT: 0.25
C3 C16 = qualified_1:C; HEIGHT: 0.35
C5 = qualified_1:C; DM: 0; DR: 270.000; DX: 71.300; DY: 21.800; HEIGHT: 0.51; SHEETNO: 1
C7 C28 = qualified_1:C; HEIGHT: 0.5
C10 = qualified_1:C
C17 C18 C24 = qualified_1:C; HEIGHT: 0.51
C44 = qualified_1:C; DM: 0; DR: 0.000; DX: 74.600; DY: 25.600; HEIGHT: 0.51; SHEETNO: 1
FD1-FD6 = qualified_1:FIDUCIAL; HEIGHT: 0
IC1 = qualified_1:TPS62111; DM: 0; DR: 180.000; DX: 74.800; DY: 22.000; HEIGHT: 1; SHEETNO: 1
IC2 = qualified_1:AT24C*: 2-wire serial EEPROM; HEIGHT: 1
J1 = qualified_1:1000BASET_POE: WE-RJ45LAN 10/100/1000 BaseT PoE+ http://katalog.we-online.de/pbs/datasheet/7499511440.pdf
J2 J3 = qualified_1:DF40C-100DS-0.4V(51): DF40 Series 100 Position Dual Row 0.4 mm Pitch Surface Mount Vertical Receptacle; DESCRIPTION: DF40 Series 100 Position Dual Row 0.4 mm Pitch Surface Mount Vertical Receptacle; DIGI-KEY_PART_NUMBER: H11615CT-ND; DIGI-KEY_PURCHASE_URL: https://www.digikey.ca/product-detail/en/hirose-electric-co-ltd/DF40C-100DS-0.4V_51_/H11615CT-ND/1969495?utm_source=snapeda&utm_medium=aggregator&utm_campaign=symbol; MF: Hirose; MP: DF40C-100DS-0.4V_51_; PACKAGE: None
J4 = qualified_1:FPC-15: FPC 15 Connector 15 pin 1mm pitch FPC connector
L1 L2 = qualified_1:L; HEIGHT: 1.9
M1 = qualified_1:SPH0645LM4H-B: Mic Mems Digital I2s Omni -26db; DESCRIPTION: Mic Mems Digital I2s Omni -26db; DIGI-KEY_PART_NUMBER: 423-1405-1-ND; DIGI-KEY_PURCHASE_URL: https://www.digikey.com/product-detail/en/knowles/SPH0645LM4H-B/423-1405-1-ND/5332432?utm_source=snapeda&utm_medium=aggregator&utm_campaign=symbol; MF: Knowles; MP: SPH0645LM4H-B; PACKAGE: SIP-7 Bourns
MP1-MP4 = qualified_1:BULLET_CONN: Bullet connector (for RC) solder pad.
Q1 Q2 Q6 = qualified_1:BSS138: N-Channel Enhancement MOSFET; HEIGHT: 1.12
Q3-Q5 Q7 Q8 = qualified_1:MOSFET_P_ENH; HEIGHT: 1.12
R1-R4 R6-R14 R16-R18 R20 R21 R23-R25 R30-R40 R43 R44 R46-R55 R58 R60 = qualified_1:R; HEIGHT: 0.25
R5 R19 R22 R26-R29 = qualified_1:R; HEIGHT: 0.35
R41 R45 = qualified_1:R; HEIGHT: 0.5
R42 = qualified_1:R; HEIGHT: 0.51
R61 R62 = qualified_1:R; DM: 0; DR: 270.000; DX: 72.800; DY: 18.400; HEIGHT: 0.35; SHEETNO: 1
S1 = qualified_1:EVQ
U2 = qualified_1:AG9700: Ag9700 Power-Over-Ethernet Module https://www.silvertel.com/images/datasheets/Ag9700-Datasheet-low-cost-isolated-Power-over-Ethernet-PoE-module-solution.pdf
U3 U4 = qualified_1:TPD4E02B04: TPD4E02B04 4-Channel ESD Protection Diode for USB Type-C and HDMI 2.0 http://www.ti.com/lit/ds/symlink/tpd4e02b04.pdf
U5 = qualified_1:G313-06329-00
U6 = qualified_1:NCP308: The NCP308 series is one of the ON Semiconductor Supervisory circuit IC families. It is optimized to monitor system voltages from 0.405 V to 5.5 V, asserting an active low open−drain RESET output, together with Manual Reset (MR) Input.
U7 = qualified_1:TCR2EF18: The TCR2EF and TCR2EE series are CMOS single-output voltage regulators with an on/off control input, featuring low dropout voltage, low output noise voltage and fast load transient response. These voltage regulators are available in fixed output voltages between 1.0 V and 5.0 V and capable of driving up to 200 mA. They feature overcurrent protection, an Auto-discharge function. The TCR2EF and TCR2EE series has a low dropout voltage of 180 mV ( 2.5 V output, IOUT = 150 mA) with low output noise voltage of 35 μVrms (2.5 V output) and a load transient response of only ⊿ VOUT = ±60 mV ( IOUT = 1 mA⇔150 mA, COUT =1.0 μF). Thus, the TCR2EF and TCR2EE series are suitable for sensitive power supply such as Analog and RF applications.
U$2 = qualified_1:GEPPETTO_LABEL; BOARD: PCB900000001527v1; TITLE: CM4 PoE Smart Camera; YEAR: 2020
U$3 = qualified_1:GEPPETTO_LOGO

## Net classes
1 supply: width 0.254 mm
2 analog: width 0.178 mm
4 xxwide: width 0.203 mm
5 USB: width 0.2 mm, clearance 0.2 mm
6 HDMI: width 0.2 mm, clearance 0.3 mm
7 50_OHM: width 0.378 mm, clearance 0.3 mm